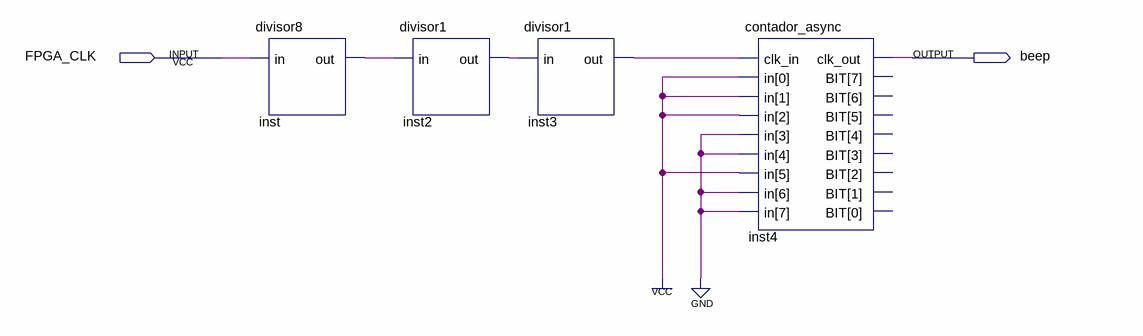
[diagram p0: schematic sheet]
// Quartus schematic buzzer_622hz.bdf as structural Verilog: 4 symbols, 2 pins
module buzzer_622hz (
  input  FPGA_CLK,
  output beep
);

  wire inst2_out, inst3_out, inst_out;

  divisor8 inst (.in(FPGA_CLK), .out(inst_out));
  divisor1 inst2 (.in(inst_out), .out(inst2_out));
  divisor1 inst3 (.in(inst2_out), .out(inst3_out));
  contador_async inst4 (.clk_in(inst3_out), .in(8'b00100111), .clk_out(beep));  // open: BIT
endmodule
